# Altium project PCB_Project.PrjPcb
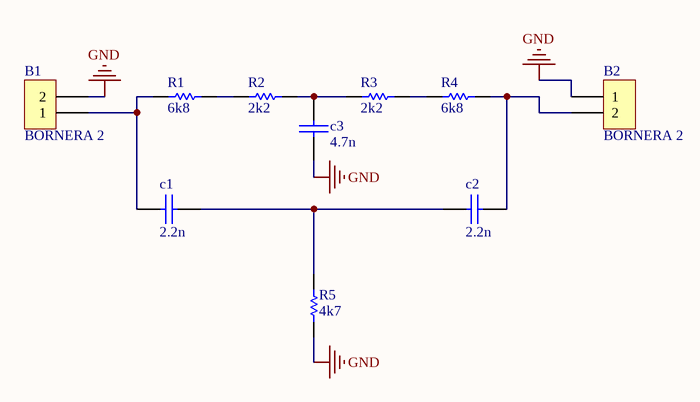
[diagram p0: ESQUEMATICO.SchDoc]
1 sheet, 10 parts. Net scope: global (net labels, ports and power ports of the same name join across sheets).
Board file: pcb.PcbDoc

## Sheet ESQUEMATICO.SchDoc
size A

### Parts
B1  BORNERA 2  [BORNERA2]
B2  BORNERA 2  [BORNERA2]
c1  2.2n  [CAP200]
c2  2.2n  [CAP200]
c3  4.7n  [CAP200]
R1  6k8  [RES400]
R2  2k2  [RES400]
R3  2k2  [RES400]
R4  6k8  [RES400]
R5  4k7  [RES400]

### Nets
GND: B1.2 B2.1 c3.2 R5.1
NetB1_1: B1.1 c1.1 R1.1
NetB2_2: B2.2 c2.2 R4.2
Netc1_2: c1.2 c2.1 R5.2
Netc3_1: c3.1 R2.2 R3.1
NetR1_2: R1.2 R2.1
NetR3_2: R3.2 R4.1

### Library data of the parts
c1-c3 = CAP
R1-R5 = RES